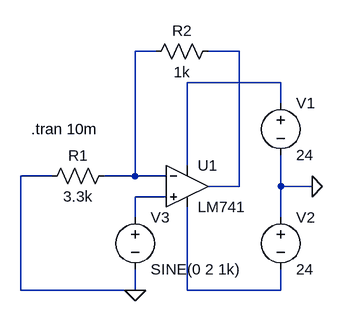
[diagram p0: schematic 7-non.asc]
7-non.asc, the LTspice schematic file:
Version 4.1
SHEET 1 880 680
WIRE 208 -32 176 -32
WIRE 336 -32 288 -32
WIRE 400 16 256 16
WIRE 400 48 400 16
WIRE 256 144 256 16
WIRE 48 160 0 160
WIRE 176 160 176 -32
WIRE 176 160 128 160
WIRE 224 160 176 160
WIRE 336 176 336 -32
WIRE 336 176 288 176
WIRE 400 176 400 128
WIRE 448 176 400 176
WIRE 224 192 176 192
WIRE 176 224 176 192
WIRE 400 224 400 176
WIRE 0 336 0 160
WIRE 176 336 0 336
WIRE 176 336 176 304
WIRE 256 336 256 208
WIRE 400 336 400 304
WIRE 400 336 256 336
FLAG 448 176 0
FLAG 176 336 0
SYMBOL LM741 256 112 R0
SYMATTR InstName U1
SYMBOL voltage 400 32 R0
SYMATTR InstName V1
SYMATTR Value 24
SYMBOL voltage 400 208 R0
SYMATTR InstName V2
SYMATTR Value 24
SYMBOL voltage 176 208 R0
WINDOW 123 0 0 Left 0
WINDOW 39 0 0 Left 0
SYMATTR InstName V3
SYMATTR Value SINE(0 2 1k)
SYMBOL res 144 144 R90
WINDOW 0 0 56 VBottom 2
WINDOW 3 32 56 VTop 2
SYMATTR InstName R1
SYMATTR Value 3.3k
SYMBOL res 304 -48 R90
WINDOW 0 0 56 VBottom 2
WINDOW 3 32 56 VTop 2
SYMATTR InstName R2
SYMATTR Value 1k
TEXT 16 88 Left 2 !.tran 10m

The netlist it stands for:
* 7-non.asc
X§U1 N004 N001 N003 N005 N002 LM741  ; pins In+ In- V+ V- OUT
V1 N003 0 24
V2 0 N005 24
V3 N004 0 SINE(0 2 1k)
R1 N001 0 3.3k
R2 N002 N001 1k
.tran 10m
.lib LM741.lib
.backanno
.end